# Altium project Pds 1st design.PrjPcb
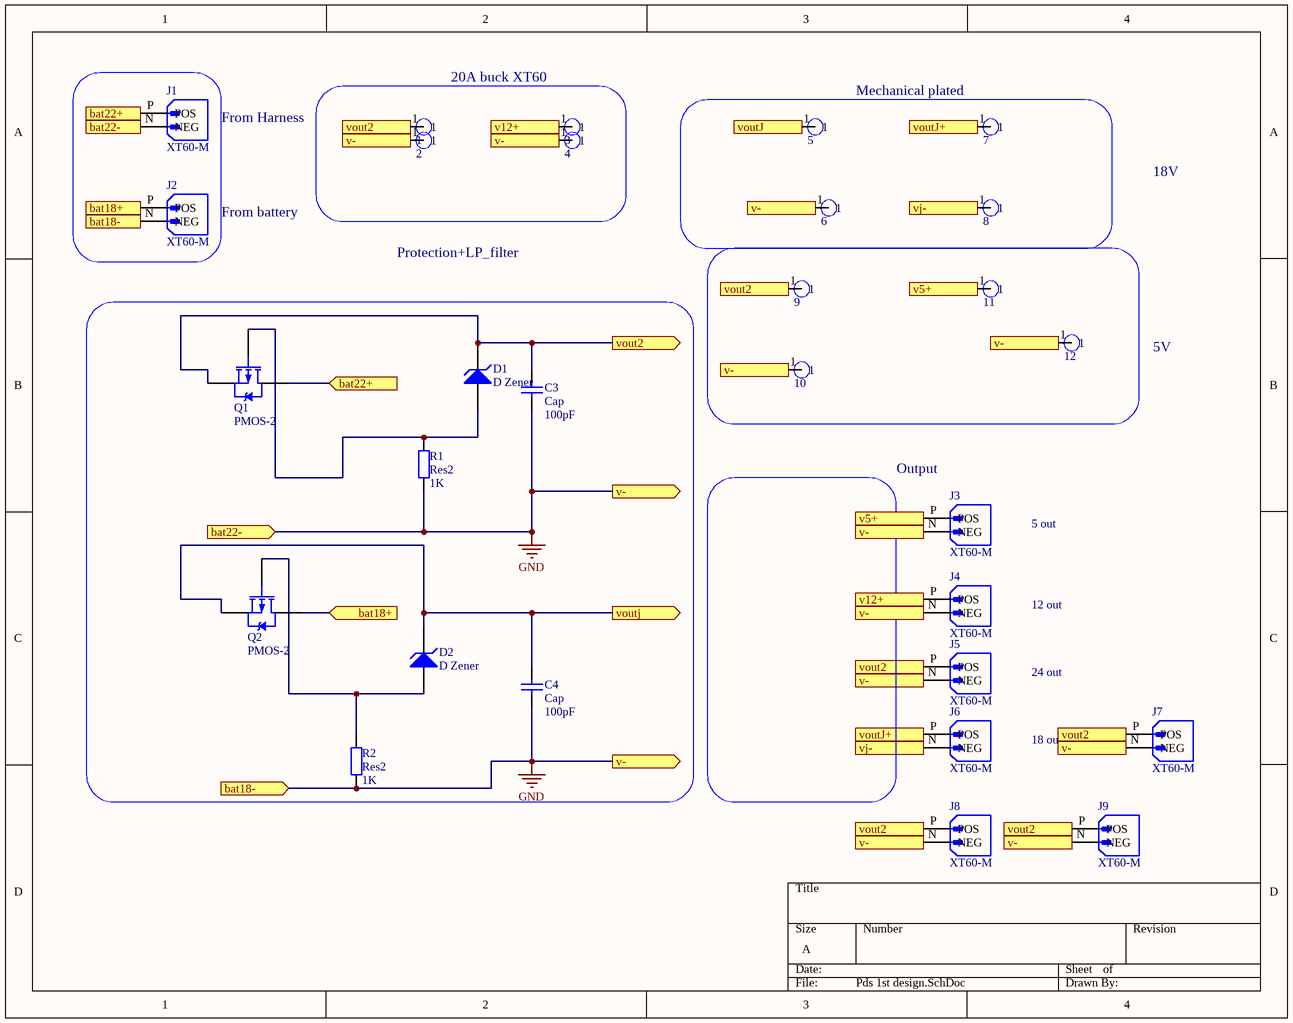
[diagram p0: Pds 1st design.SchDoc]
1 sheet, 29 parts. Net scope: flat (ports and power ports of the same name join across sheets).
Board file: Pds 1st design.PcbDoc

## Sheet Pds 1st design.SchDoc: Power distribuition system Temporary
size A; Date: 24-10-2022; CheckedBy: Meet Jain; Author: H.M.Rao; CompanyName: Mars Rover Manipal; DrawnBy: H.M.Rao; Organization: MAHE; Address3: Automobile Engineering workshop; Address4: MIT; DocumentNumber: 1; Revision: 2; SheetNumber: 1; SheetTotal: 1; Time: 9:54 AM; Rule: UNIONINDEX=0|RULEKIND=Clearance|NETSCOPE=DifferentNets|LAYERKIND=SameLayer|NAME=Schematic Clearance Constraint|GAP=10mil|GENERICCLEARANCE=10mil|IGNOREPADTOPADCLEARANCEINFOOTPRINT=FALSE|OBJECTCLEARANCES=ClearanceObj_Arc-ClearanceObj_Hole:0;ClearanceObj_Track-ClearanceObj_Hole:0;ClearanceObj_SMDPad-ClearanceObj_Hole:0;ClearanceObj_THPad-ClearanceObj_Hole:0;ClearanceObj_Via-ClearanceObj_Hole:0;ClearanceObj_Fill-ClearanceObj_Hole:0;ClearanceObj_Poly-ClearanceObj_Hole:0;ClearanceObj_Region-ClearanceObj_Hole:0;ClearanceObj_Text-ClearanceObj_Hole:0|UNIT=Metric

### Parts
1  mounting_h_p_10A buck  [mounting_h_p 10A buck]  (value not drawn)
2  mounting_h_p_10A buck  [mounting_h_p 10A buck]  (value not drawn)
3  mounting_h_p_10A buck  [mounting_h_p 10A buck]  (value not drawn)
4  mounting_h_p_10A buck  [mounting_h_p 10A buck]  (value not drawn)
5  mounting_h_p_10A buck  [mounting_h_p 10A buck]  (value not drawn)
6  mounting_h_p_10A buck  [mounting_h_p 10A buck]  (value not drawn)
7  mounting_h_p_10A buck  [mounting_h_p 10A buck]  (value not drawn)
8  mounting_h_p_10A buck  [mounting_h_p 10A buck]  (value not drawn)
9  mounting_h_p_10A buck  [mounting_h_p 10A buck]  (value not drawn)
10  mounting_h_p_10A buck  [mounting_h_p 10A buck]  (value not drawn)
11  mounting_h_p_10A buck  [mounting_h_p 10A buck]  (value not drawn)
12  mounting_h_p_10A buck  [mounting_h_p 10A buck]  (value not drawn)
C3  Cap  value 100pF  [RAD-0.3]
C4  Cap  value 100pF  [RAD-0.3]
D1  D Zener  [DIODE-0.7]
D2  D Zener  [DIODE-0.7]
J1  XT60-M  [AMASS_XT60-M]
J2  XT60-M  [AMASS_XT60-M]
J3  XT60-M  [AMASS_XT60-M]
J4  XT60-M  [AMASS_XT60-M]
J5  XT60-M  [AMASS_XT60-M]
J6  XT60-M  [AMASS_XT60-M]
J7  XT60-M  [AMASS_XT60-M]
J8  XT60-M  [AMASS_XT60-M]
J9  XT60-M  [AMASS_XT60-M]
Q1  PMOS-2  [TO-220AB]
Q2  PMOS-2  [TO-220AB]
R1  Res2  value 1K  [AXIAL-0.4]
R2  Res2  value 1K  [AXIAL-0.4]

### Blocks framed on the sheet
20A buck XT60: 1-4
Mechanical plated: 5-8

### Ports
bat18+ (in), bat18- (in), bat22+ (in), bat22- (in), v5+, v5+ (in), v12+, v12+ (in), v-, v- (in), v- (out), vj-, vj- (in), vout2, vout2 (in), vout2 (out), voutJ, voutj (out), voutJ+, voutJ+ (in)

### Nets
GND: 2.1 4.1 6.1 10.1 12.1 C3.1 C4.1 J1.N(NEG) J2.N(NEG) J3.N(NEG) J4.N(NEG) J5.N(NEG) J7.N(NEG) J8.N(NEG) J9.N(NEG) R1.1 R2.1 ; port bat22-, port v-, port bat18-
Net1_1: 1.1 9.1 C3.2 D1.2(K) J5.P(POS) J7.P(POS) J8.P(POS) J9.P(POS) Q1.3(S) ; port vout2
Net3_1: 3.1 J4.P(POS) ; port v12+
Net5_1: 5.1 C4.2 D2.2(K) Q2.3(S) ; port voutj, port voutJ
Net7_1: 7.1 J6.P(POS) ; port voutJ+
Net8_1: 8.1 J6.N(NEG) ; port vj-
Net11_1: 11.1 J3.P(POS) ; port v5+
NetD1_1: D1.1(A) Q1.1(G) R1.2
NetD2_1: D2.1(A) Q2.1(G) R2.2
NetJ1_P: J1.P(POS) Q1.2(D) ; port bat22+
NetJ2_P: J2.P(POS) Q2.2(D) ; port bat18+

### Notes on the sheet
- From Harness
- From battery
- 18V
- Protection+LP_filter
- 5V
- (near J3) Output
- 5 out
- 12 out
- 24 out
- 18 out

### Library data of the parts
C3 C4 = Cap: Capacitor; Published: 8-Jun-2000; LatestRevisionDate: 17-Jul-2002; LatestRevisionNote: Re-released for DXP Platform.; PackageReference: RAD-0.3; Publisher: Altium Limited; PackageDescription: Radial Cap, Thru-Hole; 2 Leads; 0.3 in Pin Spacing
D1 D2 = D Zener: Zener Diode; Published: 8-Jun-2000; LatestRevisionDate: 17-Jul-2002; LatestRevisionNote: Re-released for DXP Platform.; PackageReference: DIODE-0.7; Publisher: Altium Limited; PackageDescription: Diode, Thru-Hole; 2 Leads; 0.7 in Pin Spacing
J1-J9 = XT60-M: Plug; DC supply; XT60; male; PIN: 2; for cable; soldered; 30A; 500V; MF: AMASS; Package: Package; Availability: Not in stock; SnapEDA_Link: https://www.snapeda.com/parts/XT60-M/AMASS/view-part/?ref=snap; Check_prices: https://www.snapeda.com/parts/XT60-M/AMASS/view-part/?ref=eda; MP: XT60-M; Price: None; Value: *
Q1 Q2 = PMOS-2: P-Channel Power MOSFET; Note: Pin 4 not drawn and electrically connected to Pin 2.; Published: 8-Jun-2000; LatestRevisionDate: 17-Jul-2002; LatestRevisionNote: Re-released for DXP Platform.; DatasheetVersion: PD-9.390D; PackageVersion: Feb-1997; PackageReference: TO-220AB; Publisher: Altium Limited; PackageDescription: TO, Thru-Hole, Vertical, Heatsink Mounted; 3 In-Line Leads; Pitch 2.54 mm; ComponentLink1Description: Manufacturer Link; ComponentLink1URL: http://www.irf.com/
R1 R2 = Res2: Resistor; Published: 8-Jun-2000; LatestRevisionDate: 17-Jul-2002; LatestRevisionNote: Re-released for DXP Platform.; PackageReference: AXIAL-0.4; Publisher: Altium Limited; PackageDescription: Axial Device, Thru-Hole; 2 Leads; 0.4 in Pin Spacing